# Altium schematic sheet ESP-Now transceiver.SchDoc
size A0; SheetNumber: 1; SheetTotal: 1
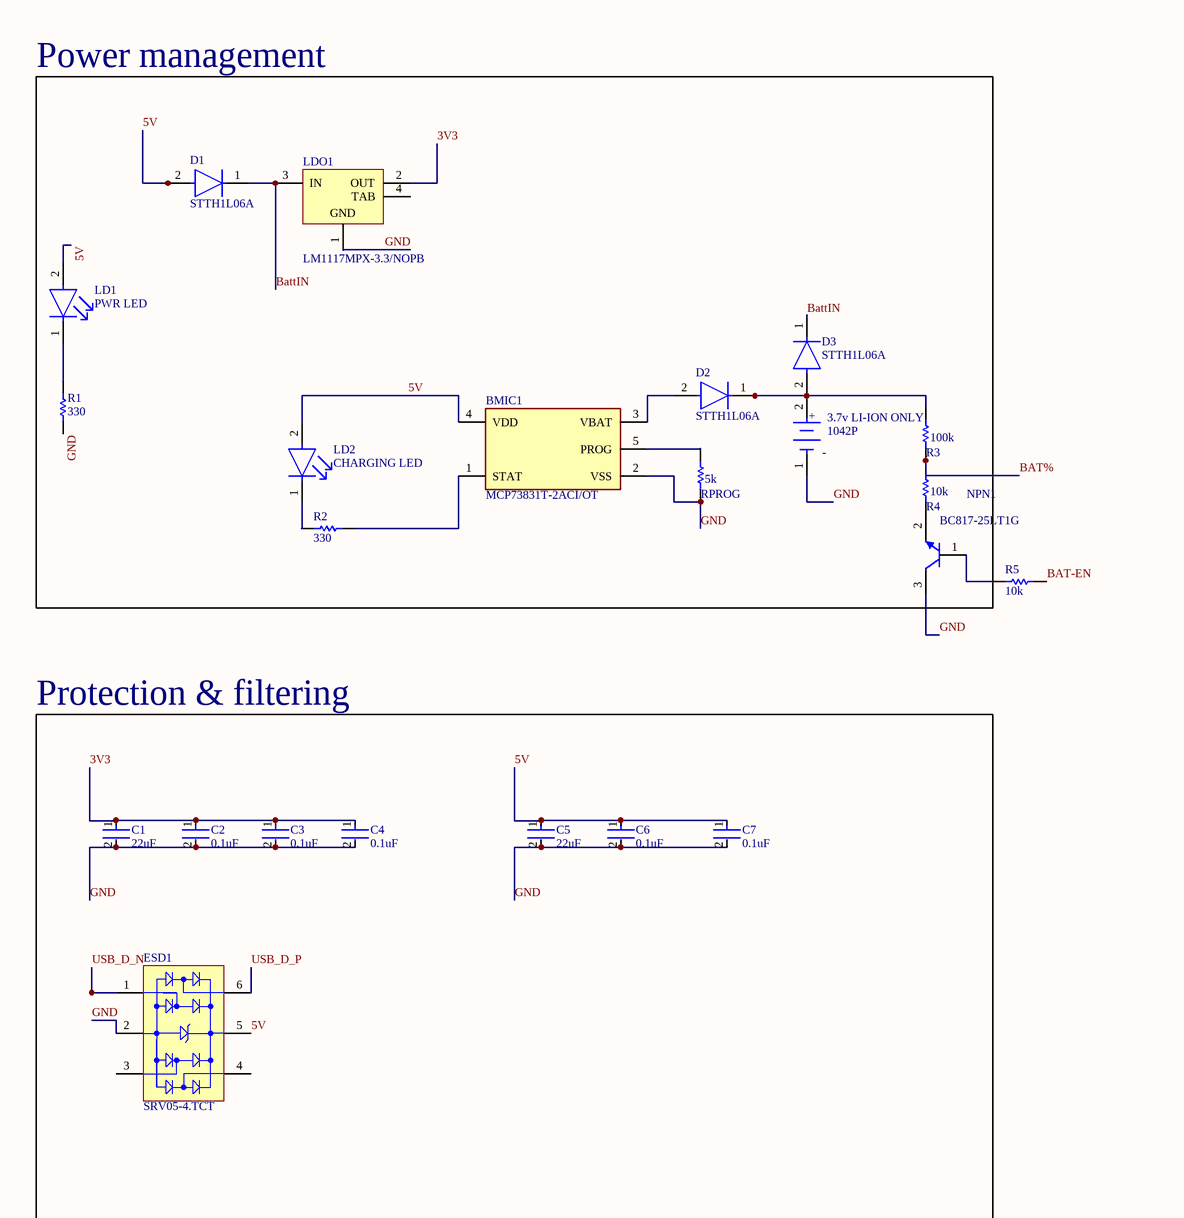
[diagram p0: ESP-Now transceiver.SchDoc, left]
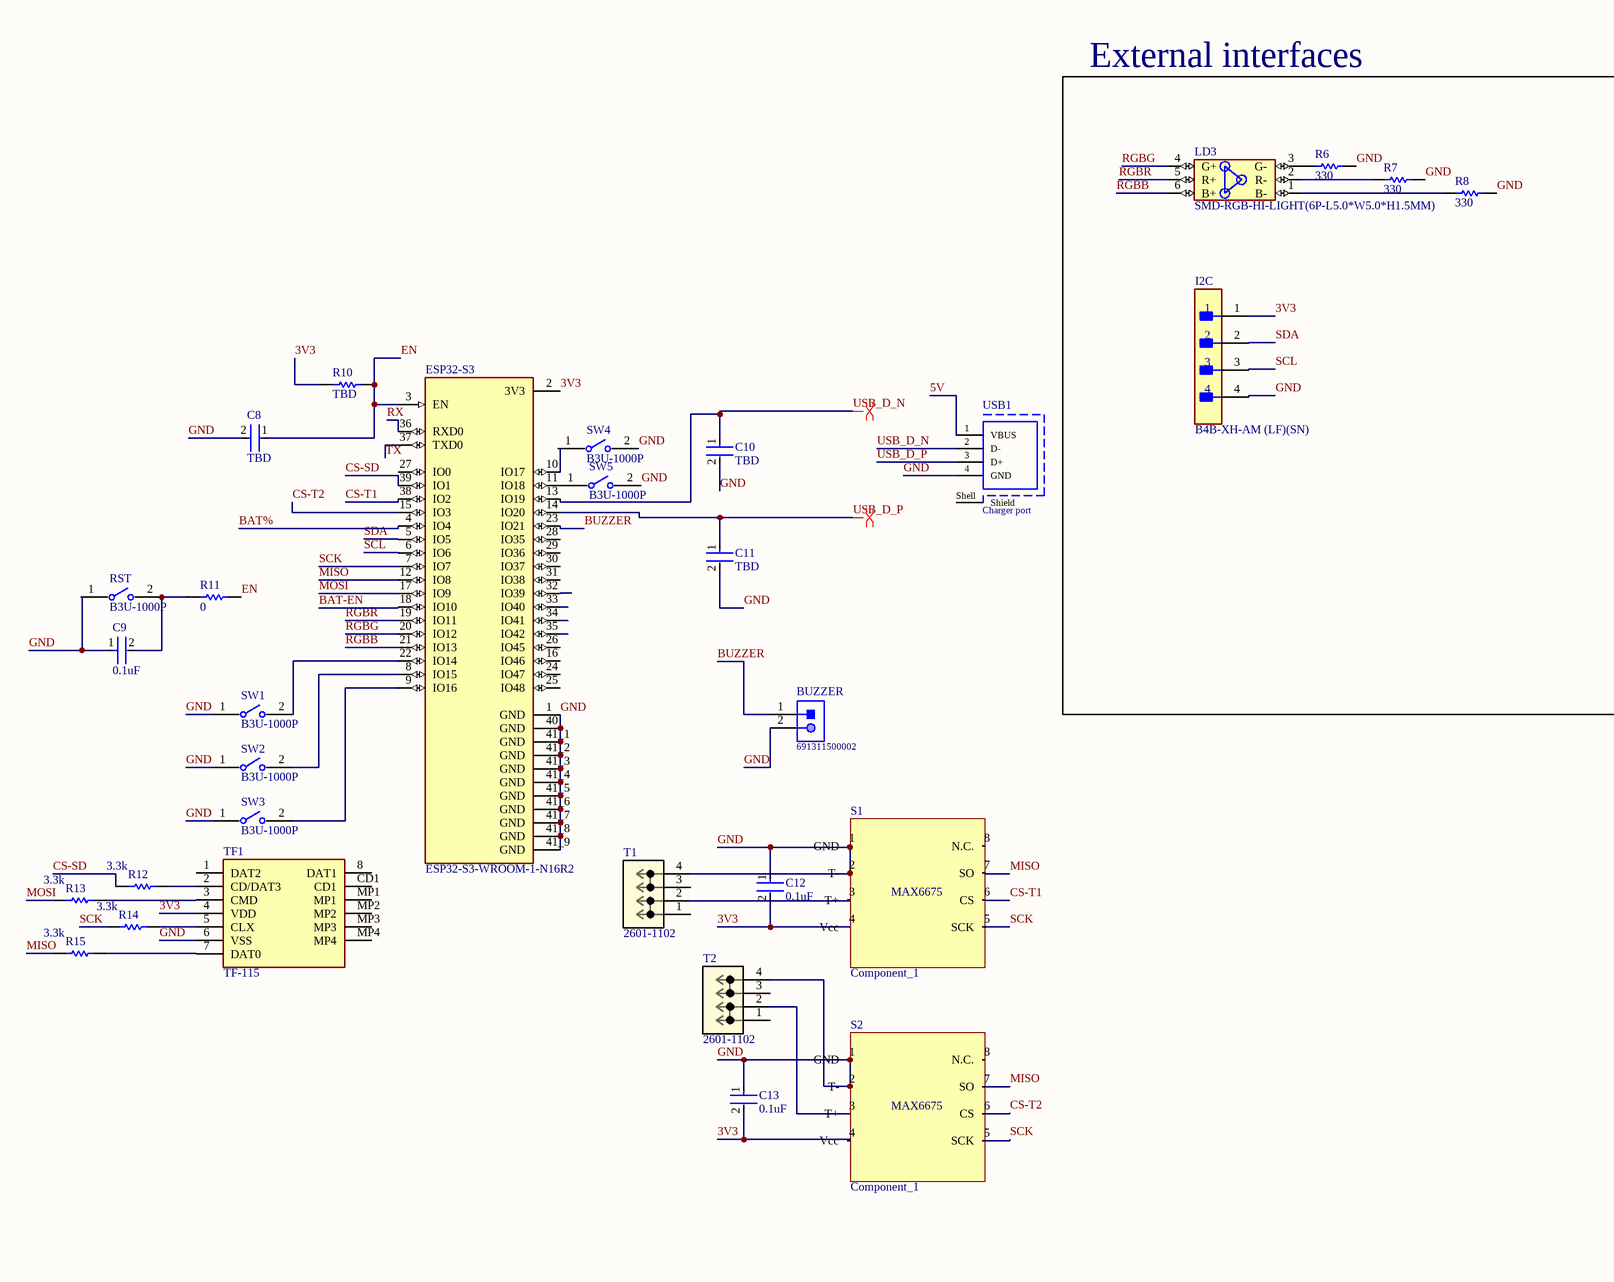
[diagram p1: ESP-Now transceiver.SchDoc, right]

## Parts
3.7v_LI-ION_ONLY  1042P  [FP-1042P-MFG]
BMIC1  MCP73831T-2ACI/OT  [FP-C04-091-OT-IPC_B]
BUZZER  691311500002  [691311500002]
C1  22uF  [FP-CC1206-1_25-MFG]
C2  0.1uF  [FP-CC1206-1_25-MFG]
C3  0.1uF  [FP-CC1206-1_25-MFG]
C4  0.1uF  [FP-CC1206-1_25-MFG]
C5  22uF  [FP-CC1206-1_25-MFG]
C6  0.1uF  [FP-CC1206-1_25-MFG]
C7  0.1uF  [FP-CC1206-1_25-MFG]
C8  TBD  [FP-CC1206-1_25-MFG]
C9  0.1uF  [FP-CC1206-1_25-MFG]
C10  TBD  [FP-CC1206-1_25-MFG]
C11  TBD  [FP-CC1206-1_25-MFG]
C12  0.1uF  [FP-CC1206-1_25-MFG]
C13  0.1uF  [FP-CC1206-1_25-MFG]
D1  STTH1L06A  [FP-SMA-MFG]
D2  STTH1L06A  [FP-SMA-MFG]
D3  STTH1L06A  [FP-SMA-MFG]
ESD1  SRV05-4.TCT  [SMTC-SOT23-6_V]
ESP32-S3  ESP32-S3-WROOM-1-N16R2  [XCVR_ESP32-S3-WROOM-1-N16R2]
I2C  B4B-XH-AM (LF)(SN)  [FP-B4B-XH-AM_LF_SN-MFG]
LD1  PWR LED  [FP-HSMG-C150-MFG]
LD2  CHARGING LED  [FP-HSMG-C150-MFG]
LD3  SMD-RGB-HI-LIGHT(6P-L5.0*W5.0*H1.5MM)  [LED6-SMD-5050]
LDO1  LM1117MPX-3.3/NOPB  [DCY0004A_L]
NPN1  BC817-25LT1G  [ONSC-SOT-23-3-318-08_V]
R1  330  [RESC3216X60X45LL10T20]
R2  330  [RESC3216X60X45LL10T20]
R3  100k  [RESC3216X60X45LL10T20]
R4  10k  [RESC3216X60X45LL10T20]
R5  10k  [RESC3216X60X45LL10T20]
R6  330  [RESC3216X60X45LL10T20]
R7  330  [RESC3216X60X45LL10T20]
R8  330  [RESC3216X60X45LL10T20]
R10  TBD  [RESC3216X60X45LL10T20]
R11  0  [RESC3216X60X45LL10T20]
R12  3.3k  [RESC3216X60X45LL10T20]
R13  3.3k  [RESC3216X60X45LL10T20]
R14  3.3k  [RESC3216X60X45LL10T20]
R15  3.3k  [RESC3216X60X45LL10T20]
RPROG  5k  [RESC3216X60X45LL10T20]
RST  B3U-1000P  [FP-B3U-1000P-MFG]
S1  Component_1  [SOIC127P600X175-8N]
S2  Component_1  [SOIC127P600X175-8N]
SW1  B3U-1000P  [FP-B3U-1000P-MFG]
SW2  B3U-1000P  [FP-B3U-1000P-MFG]
SW3  B3U-1000P  [FP-B3U-1000P-MFG]
SW4  B3U-1000P  [FP-B3U-1000P-MFG]
SW5  B3U-1000P  [FP-B3U-1000P-MFG]
T1  2601-1102  [CONN4_1-1102_WAG]
T2  2601-1102  [CONN4_1-1102_WAG]
TF1  TF-115  [TF115]
USB1  Charger port  [61400416121]

## Blocks framed on the sheet
Power management: 3.7v_LI-ION_ONLY BMIC1 D1-D3 LD1 LD2 LDO1 NPN1 R1-R4 RPROG
External interfaces: I2C LD3 R6-R8
Protection & filtering: C1-C7 ESD1

## Nets
3V3: C1.1 C2.1 C3.1 C4.1 C12.2 C13.2 ESP32-S3.2(3V3) I2C.1 LDO1.2(OUT) R10.1 S1.3(T+) S1.4(Vcc) S2.4(Vcc) T1.2 TF1.4(VDD)
5V: BMIC1.4(VDD) C5.1 C6.1 C7.1 D1.2(A) ESD1.5(VBUS) LD1.2(A) LD2.2(A) USB1.1(VBUS)
BAT%: ESP32-S3.4(IO4) R3.1 R4.2
BAT-EN: ESP32-S3.18(IO10) R5.1
BattIN: D1.1(C) D3.1(C) LDO1.3(IN)
BUZZER: BUZZER.1 ESP32-S3.23(IO21)
CS-SD: ESP32-S3.39(IO1) R12.1
CS-T1: ESP32-S3.38(IO2) S1.6(CS)
CS-T2: ESP32-S3.15(IO3) S2.6(CS)
EN: C8.1 ESP32-S3.3(EN) R10.2 R11.2
GND: 3.7v_LI-ION_ONLY.1(C) BMIC1.2(VSS) BUZZER.2 C1.2 C2.2 C3.2 C4.2 C5.2 C6.2 C7.2 C8.2 C9.1 C10.2 C11.2 C12.1 C13.1 ESD1.2(GND) ESP32-S3.1(GND) ESP32-S3.40(GND) ESP32-S3.41_1(GND) ESP32-S3.41_2(GND) ESP32-S3.41_3(GND) ESP32-S3.41_4(GND) ESP32-S3.41_5(GND) ESP32-S3.41_6(GND) ESP32-S3.41_7(GND) ESP32-S3.41_8(GND) ESP32-S3.41_9(GND) I2C.4 LDO1.1(GND) NPN1.3(C) R1.2 R6.2 R7.2 R8.2 RPROG.1 RST.1 S1.1(GND) S1.2(T-) S2.1(GND) S2.2(T-) SW1.1 SW2.1 SW3.1 SW4.2 SW5.2 T1.4 T2.4 TF1.6(VSS) USB1.4(GND)
MISO: ESP32-S3.12(IO8) R15.1 S1.7(SO) S2.7(SO)
MOSI: ESP32-S3.17(IO9) R13.1
RGBB: ESP32-S3.21(IO13) LD3.6(B+)
RGBG: ESP32-S3.20(IO12) LD3.4(G+)
RGBR: ESP32-S3.19(IO11) LD3.5(R+)
RX: ESP32-S3.36(RXD0)
SCK: ESP32-S3.7(IO7) R14.1 S1.5(SCK) S2.5(SCK)
SCL: ESP32-S3.6(IO6) I2C.3
SDA: ESP32-S3.5(IO5) I2C.2
TX: ESP32-S3.37(TXD0)
USB_D_N: C10.1 ESD1.1(I/O_1) ESP32-S3.13(IO19) USB1.2(D-)
USB_D_P: C11.1 ESD1.6(I/O_4) ESP32-S3.14(IO20) USB1.3(D+)
Net3.7v_LI-ION_ONLY_2: 3.7v_LI-ION_ONLY.2(A) D2.1(C) D3.2(A) R3.2
NetBMIC1_1: BMIC1.1(STAT) R2.2
NetBMIC1_3: BMIC1.3(VBAT) D2.2(A)
NetBMIC1_5: BMIC1.5(PROG) RPROG.2
NetC9_2: C9.2 R11.1 RST.2
NetESP32-S3_8: ESP32-S3.8(IO15) SW2.2
NetESP32-S3_9: ESP32-S3.9(IO16) SW3.2
NetESP32-S3_10: ESP32-S3.10(IO17) SW4.1
NetESP32-S3_11: ESP32-S3.11(IO18) SW5.1
NetESP32-S3_22: ESP32-S3.22(IO14) SW1.2
NetLD1_1: LD1.1(C) R1.1
NetLD2_1: LD2.1(C) R2.1
NetLD3_1: LD3.1(B-) R8.1
NetLD3_2: LD3.2(R-) R7.1
NetLD3_3: LD3.3(G-) R6.1
NetNPN1_1: NPN1.1(B) R5.2
NetNPN1_2: NPN1.2(E) R4.1
NetR12_2: R12.2 TF1.2(CD/DAT3)
NetR13_2: R13.2 TF1.3(CMD)
NetR14_2: R14.2 TF1.5(CLX)
NetR15_2: R15.2 TF1.7(DAT0)
NetS2_3: S2.3(T+) T2.2

Not connected (* = marked no-connect by the designer): ESD1 3(I/O_2) 4(I/O_3); ESP32-S3 16(IO46) 24(IO47) 25(IO48) 26(IO45) 27(IO0) 28(IO35) 29(IO36) 30(IO37) 31(IO38) 32(IO39) 33(IO40) 34(IO41) 35(IO42); LDO1 4(TAB); S1 8(N.C.); S2 8(N.C.); T1 1 3; T2 1 3; TF1 1(DAT2) 8(DAT1) CD1 MP1 MP2 MP3 MP4; USB1 Shell(Shield)

## Layout directives
differential pair: USB_D_N, USB_D_P

## Notes on the sheet
- (in symbol CMP-19636-000019-1) +; -
- (in symbol Component_1) MAX6675

## Library data of the parts
3.7v_LI-ION_ONLY = CMP-19636-000019-1: BATTERY HOLDER 18650 SMD TAB; Number of Cells: 1; Max Operating Temperature: 145°C; Termination: SMD/SMT; Mount: Surface Mount; Min Operating Temperature: -50°C; Package Quantity: 200; Packaging: Tray; Lead Free: Lead Free
BMIC1 = CMP-0133-00143-2: IC CONTROLLR LI-ION 4.2V SOT23-5; Max Power Dissipation: 1.54W; Output Current: 500mA; Max Output Voltage: 4.5V; Number of Outputs: 1; Min Output Voltage: 4.168V; Min Supply Voltage: 3.75V; Max Input Voltage: 6V; Voltage Rating: 4.534V; Drain to Source Resistance: 350mR; Max Operating Temperature: 85°C; Length: 0.122inch; Number of Pins: 5; REACH SVHC: No SVHC; Radiation Hardening: No; Min Operating Temperature: -40°C; Weight: 0.00709oz; Contact Plating: Tin; Termination: SMD/SMT; Case/Package: SOT-23; Mount: Surface Mount; Width: 0.071inch; Packaging: Tape and Reel; Number of Cells: 1; Max Charge Current: 500mA; Height: 0.051inch; Number of Channels: 1; Output Voltage: 4.2V; Max Supply Voltage: 6V; Lead Free: Lead Free
BUZZER = CMP-1502-02123-1: Serie 311 - 5.08mm Open Vertical PCB Header WR-TBL, 2 pin; Manufacturer: Wurth Elektronik; Gender: Male; Pin Number: 2; Packaging: Box; Mounting Technology: THT; Operating Temperature: -40to105degC; Package Reference: 691311500002; Manufacturer URL: http://www.we-online.de; Part Number: 691311500002; Publisher: WurthElektronik; Datasheet URL: http://katalog.we-online.de/em/datasheet/6913115000xx.pdf; Pitch: 5.08mm
C1-C13 = CMP-03422-000842-1: CAP CER 0.1UF 50V X7R 1206; Manufacturer: Yageo; Manufacturer Part Number: CC1206KRX7R9BB104; Automotive Grade: NA; Value: 100 nF; Tolerance: 0.1; Material: Ceramic; Temperature Coefficient: 15%; Temperature Characteristic: X7R; Device Class L1: Passive Components; Lead Free: Yes; Octopart: https://octopart.com/cc1206krx7r9bb104-yageo-39467816; Category: Cap; Temperature Range Low: -55°C; Device Class L3: Ceramic Capacitors; Voltage Rating: 50 V; Temperature Range High: +125°C; Device Class L2: Capacitors; RoHS: TRUE; Package: CC1206-1.25; Footprint Url: http://www.yageo.com/exep/pages/download/literatures/UPY-C_GEN_24.pdf; ComponentLink2Description: Datasheet; Temperature: -55°C to +125°C; Capacitance: 100 nF; Digikey Description: CAP CER 0.1UF 50V X7R 1206; Height: 1.45mm; Automotive: No; Mouser Description: Multilayer Ceramic Capacitors MLCC - SMD/SMT 100nF 50V X7R 10%; ComponentLink2URL: http://www.yageo.com/documents/recent/UPY-NP0X7R_HV_1KV-to-3KV_11.pdf
D1-D3 = CMP-12188-000002-1: DIODE GEN PURP 600V 1A SMA; Manufacturer: STMicroelectronics; Standoff Height: 0.05mm; Max Surge Forward Current: 20A; Peak Reverse Current: 1uA; Max Junction Temp: +175°C; ComponentLink2URL: https://www.st.com/content/ccc/resource/technical/document/datasheet/e9/c2/09/e3/32/47/44/bd/CD00002694.pdf/files/CD00002694.pdf/jcr:content/translations/en.CD00002694.pdf; Temperature: to +175°C; Device Class L1: Discrete Semiconductors; Automotive: No; Digikey Description: DIODE GEN PURP 600V 1A SMA; Octopart: https://octopart.com/stth1l06a-stmicroelectronics-324385; Device Class L3: Rectifier Diodes; Max Repetitive Reverse Voltage: 600V; Lead Free: Yes; Forward Current: 1A; Package: SMA; ComponentLink2Description: Datasheet; Category: Diode; Mouser Description: DIODE GEN PURP 600V 1A SMA; RoHS: TRUE; Temperature Range High: +175°C; Height: 2.65mm; Device Class L2: Diodes; Manufacturer Part Number: STTH1L06A
ESD1 = CMP-2000-05358-1: RailClamp(R) Low Capacitance TVS Diode Array, 5 pF, 17.5 VC, -55 to 125 degC, 6-Pin SOT23, RoHS, Tape and Reel; Manufacturer: Semtech; Leakage Current (Max): 5uA; Polarity: Uni-Directional; Peak Pulse Power Dissipation: 300W; Clamping Voltage: 17.5V; Number of Elements: 1; Working Voltage: 5V; Test Current (It): 1mA; Configuration: Quad; Reverse Breakdown Voltage: 6V; Suppressor Type: DiodeArrays; Peak Pulse Current: 12A; Product Depth (mm): 1.6mm; Product Height (mm): 1.15mm; Clamping Voltage (Max): 12.5V; Rad Hardened: No; Product Length (mm): 2.9mm; Capacitance Value: 5pF; Mounting: SurfaceMount; Datasheet URL: https://datasheet.ciiva.com/8029/srv05-4-8029973.pdf; Datasheet Version: Jan-08; Packaging: TapeandReel; Package / Case: SOT-23; Operating Temp Range: -55Cto125C; Pin Count: 6; Direction Type: Uni-Directional; Operating Temperature Min Deg. C: -55C; Reverse Stand-off Voltage: 5V; Leakage Current: 5uA; Manufacturer URL: http://www.semtech.com/; Working Voltage (Max): 5V; Package Reference: SOT23-6; Package Description: 6-Pin Small Outline Transistor, Body 2.9 x 1.6 mm, Pitch 0.95 mm; Operating Temperature Max Deg. C: 125C; Operating Temperature Classification: Military; Mounting Style: SurfaceMount
ESP32-S3 = ESP32-S3-WROOM-1-N16R2: Bluetooth, WiFi 802.11b/g/n, Bluetooth v5.0 Transceiver Module 2.4GHz PCB Trace Surface Mount; MF: Espressif Systems; Package: None; Availability: In Stock; SnapEDA_Link: https://www.snapeda.com/parts/ESP32-S3-WROOM-1-N16R2/Espressif+Systems/view-part/?ref=snap; MP: ESP32-S3-WROOM-1-N16R2; Value: *; Purchase-URL: https://pricing.snapeda.com/search/part/ESP32-S3-WROOM-1-N16R2/?ref=eda; Price: None; Check_prices: https://www.snapeda.com/parts/ESP32-S3-WROOM-1-N16R2/Espressif+Systems/view-part/?ref=eda
I2C = CMP-17439-000117-1: CONN HEADER VERT 4POS 2.5MM; Max Current Rating: 3A; Gender: Male; Contact Resistance: 20mR; Number of Positions: 4; Mated Stacking Heights: 9.8mm; Voltage Rating: 250V; Length: 12.4mm; Orientation: Straight; Pitch: 2.5mm; Housing Material: Polyamide; Max Operating Temperature: 85°C; Fastening Type: Detent; Housing Color: White; Series: XH; Packaging: Bulk; Number of Rows: 1; Insulation Material: Nylon; Contact Plating: Copper; Contact Type: Male Pin; Connector Type: Header; Color: Green; Insulation Color: Natural; Contact Finish - Mating: TIN; Lead Free: Lead Free; Termination: Solder; Depth: 5.75mm; Number of Pins: 4; Contact Material: Brass; Mount: Through Hole; Max Voltage Rating (AC): 250V; Flammability Rating: UL94 V-0; Min Operating Temperature: -25°C; Contact Shape: Square
LD1 LD2 = CMP-2000-05061-2: LED GREEN DIFFUSED 1206 SMD; Manufacturer Part Number: HSMG-C150; Manufacturer: Broadcom; Led Orientation: Top View; Max Junction Temp: +95°C; Peak Emmision Wavelength: 570nm; Viewing Angle: 170°; Wavelength: 572nm; Reverse Voltage: 5V; Luminous Intensity: 15mcd; Forward Voltage: 2.2V; Power Dissipation: 65mW; Forward Current: 20mA; ComponentLink2Description: Datasheet; Lead Free: Yes; Temperature Range Low: -40°C; Package: HSMG-C150; Digikey Description: LED GREEN DIFFUSED 1206 SMD; Mouser Description: LED Uni-Color Green 570nm 2-Pin Chip LED T/R; Temperature Range High: +85°C; Device Class L1: Optoelectronics; Colour: Green; Category: Diode; Device Class L3: unset; RoHS: TRUE; Height: 1.2mm; ComponentLink2URL: https://docs.broadcom.com/docs/AV02-0551EN; Device Class L2: LEDs; Automotive: No; Ipc Land Pattern Name: DIOCP320160X55; Octopart: https://octopart.com/hsmg-c150-broadcom-71131304; Temperature: -40°C to +85°C
LD3 = SMD-RGB-HI-LIGHT(6P-L5.0*W5.0*H1.5MM): Addressable Lighting - 1 LED Discrete PWM Red, Green, Blue (RGB) 5.00mm L x 5.00mm W; MF: SparkFun Electronics; MP: 5050RGB; Check_prices: https://www.snapeda.com/parts/5050RGB/SparkFun+Electronics/view-part/?ref=eda; SnapEDA_Link: https://www.snapeda.com/parts/5050RGB/SparkFun+Electronics/view-part/?ref=snap; Availability: Not in stock; Value: *; Price: None; Package: SparkFun Electronics
LDO1 = CMP-0062-01639-4: 800mA Low-Dropout Linear Regulator, 4-pin SOT-223, Pb-Free; Manufacturer: Texas Instruments; High-Reliability: Y; PowerWise: N; PackageTopMarking: XYTT*N05A; CompType: LDO IC; ComponentLink1URL: http://www.ti.com/general/docs/lit/getliterature.tsp?genericPartNumber=LM1117-N&fileType=pdf; PartNumber: LM1117MPX-3.3/NOPB; ComponentLink1Description: Datasheet URL; PinCount: 4; Code_JEDEC: TO-261-AA; PackageDescription: Molded SOT-223, 6.50 x 3.56 x 1.6mm Body, 4 Lead, 2.3mm Pitch; PackageReference: DCY0004A; RoHS: Y; Code_IPC: SOT223-4
NPN1 = CMP-1048-00737-1: General Purpose Transistor, NPN Silicon, 3-Pin SOT-23, Pb-Free, Tape and Reel; Manufacturer: On Semiconductor; IC Continuous (A): 0.5; fT Min (MHz): 100; PackageDescription: 3-Pin Small Outline Transistor, Body 2.92 x 1.3 mm, Pitch 0.95 mm; ComponentLink3Description: Package Specification; ComponentLink2Description: Datasheet; RoHS: TRUE; PackageVersion: Rev. AP, 11/2009; ComponentLink1URL: http://www.onsemi.com/; PackageReference: SOT-23-3-318-08; ComponentLink3URL: http://www.onsemi.cn/pub_link/Collateral/318-08.PDF; ComponentLink2URL: http://www.onsemi.com/pub_link/Collateral/BC817-16LT1-D.PDF; Mounting Technology: Surface Mount; Packing: Tape and Reel; DatasheetVersion: Rev. 12; Polarity: NPN; PartNumber: BC817-25LT1G; ComponentLink1Description: Manufacturer URL
R1-R8 R10-R15 RPROG = CMP-2003-02213-1: Part Number: CRCW120647K0FKEA; Manufacturer: Vishay Dale
RST SW1-SW5 = CMP-2100-03586-2: SWITCH TACTILE SPST-NO 0.05A 12V; Contact Resistance: 100mR; Operating Force: 1.5N; Max Current Rating: 50mA; Switch Travel: 0.15mm; Actuator Type: Standard; Mechanical Life: 200000Cycles; Ratings: Dust Proof; Illumination Type: Non-Illuminated; Throw Configuration: SPST; Actuator Length: 0.4mm; Switch Function: Off-Mom; Height: 1.2mm; Width: 3mm; Weight: 0.000776oz; Contact Material: Silver; Max Voltage Rating (DC): 12V; Insulation Resistance: 100MR; Lead Free: Lead Free; Current Rating: 50mA; Termination: SMD/SMT; Length: 4mm; Voltage Rating (DC): 12V; Contact Current Rating: 50mA; Orientation: Straight; Depth: 2.5mm; Max Operating Temperature: 70°C; Packaging: Tape and Reel; Min Operating Temperature: -25°C; Package Quantity: 1; Mount: Surface Mount; Electrical Life: 200000Cycles
T1 T2 = 2601-1102: No Description Available; Mfr_Name: Wago; Type: Wire to Board; RefDes: RefDes
TF1 = TF-115: Connector - Card Sockets 8 14.5x14.75x1.85mm RoHS; Manufacturer_Name: XUNPU; Geometry.Height: 2mm; Manufacturer_Part_Number: TF-115; Mouser Part Number: *; Mouser Price/Stock: *; Arrow Part Number: *; Arrow Price/Stock: *; Datasheet Link: https://datasheet.lcsc.com/szlcsc/XUNPU-TF-115_C266620.pdf
USB1 = CMP-1502-03243-1: USB 2.0 Type B Receptacle WR-COM, Horizontal, THT, with Pads and Pegs; Manufacturer: Wurth Elektronik; Contact Resistance: 20mOhm; Rated Current: 1.5A; Working Voltage: 30VAC; Package Reference: 61400416121; Part Number: 61400416121; Packaging: Tray; Mounting Technology: THT; Gender: Receptacle; Datasheet URL: https://katalog.we-online.de/em/datasheet/61400416121.pdf; Publisher: WurthElektronik; Orientation: Horizontal; Connector Type: USB2.0TypeB; Operating Temperature: -40to105degC; Manufacturer URL: http://www.we-online.de